# Altium schematic sheet Module_Wi-Fi.SchDoc
size A4; Author: Jérémie Jean-Elie; SheetNumber: 6; SheetTotal: 7; Version: E
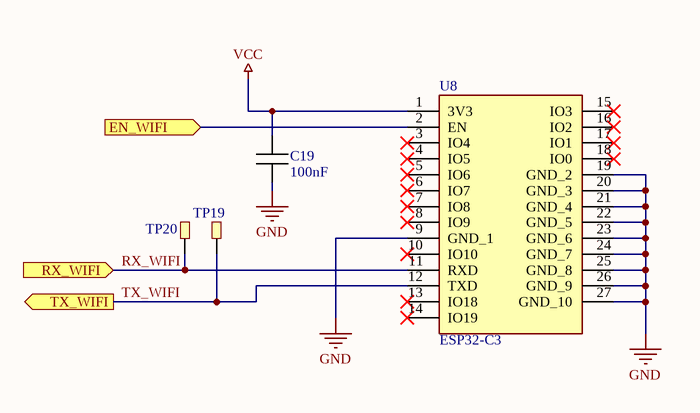
[diagram p0: Module_Wi-Fi.SchDoc]

## Parts
C19  100nF  [CAPC1608X08M]
TP19  TestPoint  [KEYSTONE_5019]  (value not drawn)
TP20  TestPoint  [KEYSTONE_5019]  (value not drawn)
U8  ESP32-C3  [ESP32_C3]

## Ports
EN_WIFI (in, see Schema_bloc[3B], Microcontroleur[4B]), RX_WIFI (in, see Schema_bloc[3B], Microcontroleur[1B]), TX_WIFI (out, see Schema_bloc[3B], Microcontroleur[1B])

## Nets
GND: C19.1 U8.9(GND_1) U8.19(GND_2) U8.20(GND_3) U8.21(GND_4) U8.22(GND_5) U8.23(GND_6) U8.24(GND_7) U8.25(GND_8) U8.26(GND_9) U8.27(GND_10)
VCC: C19.2 U8.1(3V3)
EN_WIFI: U8.2(EN) ; port EN_WIFI
RX_WIFI: TP20.1 U8.11(RXD) ; port RX_WIFI
TX_WIFI: TP19.1 U8.12(TXD) ; port TX_WIFI

Not connected (* = marked no-connect by the designer): U8 3(IO4)* 4(IO5)* 5(IO6)* 6(IO7)* 7(IO8)* 8(IO9)* 10(IO10)* 13(IO18)* 14(IO19)* 15(IO3)* 16(IO2)* 17(IO1)* 18(IO0)*

## Notes on the sheet
- Fichier :
- a
- Date :
- Heure :
- Version :
- Auteur :
- Modif.
- b
- c
- d
- Projet :
- No :
- Nb feuilles
- Feuille n°
- Chemin :

## Library data of the parts
C19 = CMP-065-000000-2: CAPC 100nF X7R 50V 10% 1608 (0603 INCH); Manufacturer: TDK; Manufacturer Number: CGA3E2X7R1H104K080AA; IsStocked: 1; PN: PN-338083; Current: NULL; TemperatureRange: -55°C to +125°C; Voltage: 50V; Dielectric: X7R; Value: 100nF; Category: Passives; Supplier Price 1: 0.0100; Supplier Part Number 1: FAB.0603_C 100n; SubCategory: Condensateurs ceramique; Tolerance: ±10%; Supplier 1: ETML; TemperatureCoeff: NULL; Power: NULL